# EasyEDA schematic SCH_LM2596_2023-11-16.json
TITLE: Sheet_1; REV: 1.0; Date: 2023-11-16; Sheet: 1/1; Drawn By: fabian.figueroa; Company: Your Company
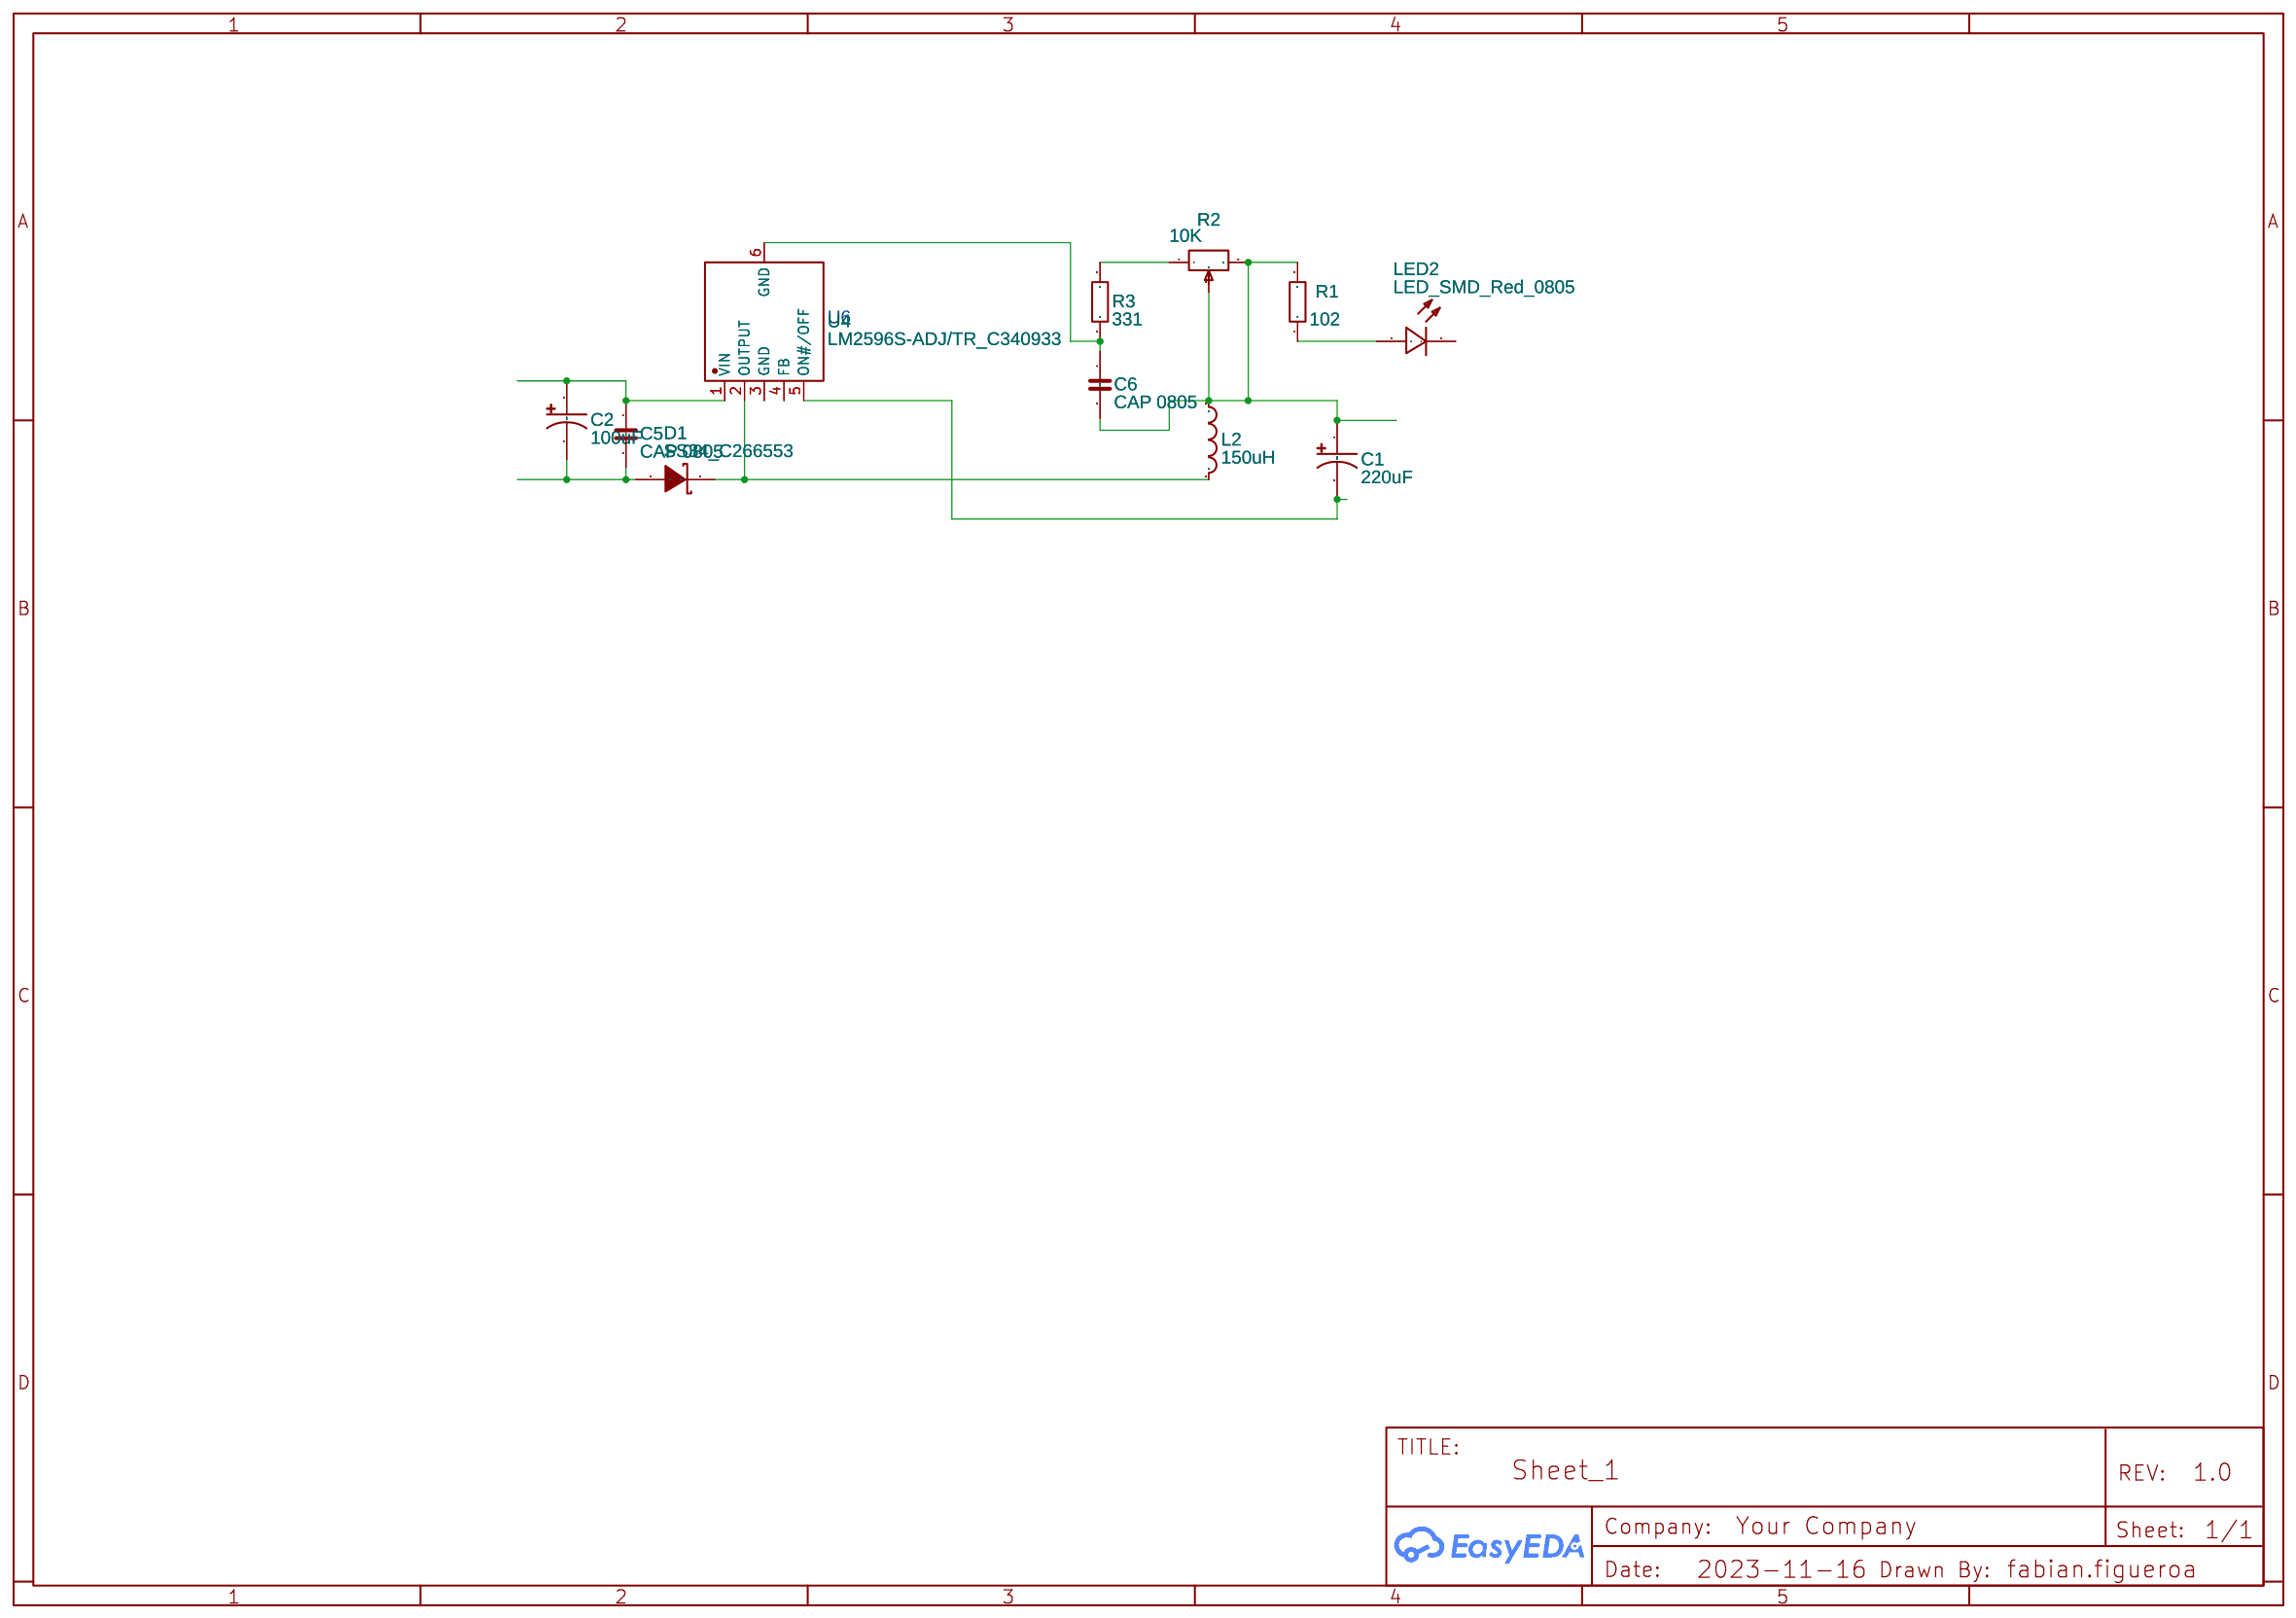
[diagram p0: schematic sheet]

## Parts
C1  220uF  [CAP-SMD_BD8.0-L8.3-W8.3-FD]
C2  100uF  [CAP-SMD_BD8.0-L8.3-W8.3-FD]
C5  CAP 0805  [0805]
C6  CAP 0805  [0805]
D1  SS34_C266553  [SMA_L4.4-W2.8-LS5.4-RD]
L2  150uH  [L-SMD-12X12X8MM]
LED2  LED_SMD_Red_0805  [LED_SMD_0805_JD]
R1  102  [RES 0805]
R2  10K  [RES-ADJ-TH_3296W]
R3  331  [RES 0805]
U4  LM2596S-ADJ/TR_C340933  [TO-263-5_L10.6-W9.6-P1.70-LS15.9-BR]

## Library data of the parts
C1 = MVK35VC220M8*10_8.0TP: Supplier: LCSC; Supplier Part: C346958; Manufacturer: SamYoung Electronics; Contributor: LCSC
C2 = BXJ-35V100-8*10: Supplier: LCSC; Supplier Part: C165636; Manufacturer: SamYoung Electronics; Contributor: LCSC
C5 C6 = CAP 0805: Contributor: mitch
D1 = SS34_C266553: Supplier: LCSC; Supplier Part: C266553; Manufacturer: Bourne Semicon (Shenzhen); Manufacturer Part: SS34; Contributor: LCSC; LCSC Assembly: Yes; SMT Type: Extend
L2 = CDRH127/LDNP-151MC: Supplier: LCSC; Supplier Part: C338769; Manufacturer: Sumida; Contributor: LCSC
LED2 = LED_SMD_Red_0805: Supplier: LCSC; Manufacturer: Everlight Elec; Manufacturer Part: 17-21SURC/S530-A2/TR8; Supplier Part: C131244; Contributor: spiderjuka
R1 R3 = RES 0805
R2 = 3296W-1-103LF: Supplier: LCSC; Manufacturer: BOURNS; Supplier Part: C34846
U4 = LM2596S-ADJ/TR_C340933: Supplier: LCSC; Supplier Part: C340933; Manufacturer: Huaguan Semicon; Manufacturer Part: LM2596S-ADJ/TR; Contributor: LCSC

## Nets
Net-(C1-1): C1.1 C6.2 L2.1 R1.2 R2.2 R2.3
Net-(C1-2): C1.2 U4.5(ON#/OFF)
Net-(C2-1): C2.1 C5.1 U4.1(VIN)
Net-(C2-2): C2.2 C5.2 D1.2(A)
Net-(C6-1): C6.1 R3.1 U4.6(GND)
Net-(D1-1): D1.1(C) L2.2 U4.2(OUTPUT)
Net-(LED2-1): LED2.1(+) R1.1
Net-(R2-1): R2.1 R3.2

Not connected (* = marked no-connect by the designer): LED2 2(-); U4 3(GND) 4(FB)

## Notes on the sheet
- U6
